# EAGLE schematic Team26vFinal (EAGLE 8.0.2)

## Sheet 1 of 2
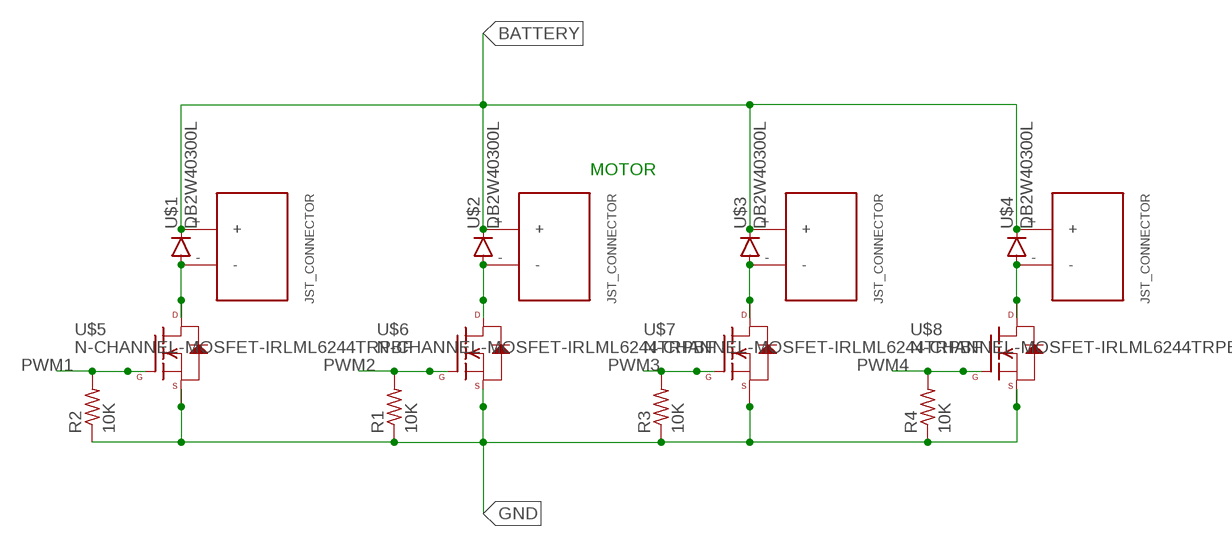
[diagram p0: schematic, sheet 1]

### Parts
MOTOR  JST_CONNECTOR_FEMALE  [JST_CONNECTOR_FEMALE]
MOTOR1  JST_CONNECTOR_FEMALE  [JST_CONNECTOR_FEMALE]
MOTOR2  JST_CONNECTOR_FEMALE  [JST_CONNECTOR_FEMALE]
MOTOR3  JST_CONNECTOR_FEMALE  [JST_CONNECTOR_FEMALE]
R1  10K  R-US_R0603  [R0603]
R2  10K  R-US_R0603  [R0603]
R3  10K  R-US_R0603  [R0603]
R4  10K  R-US_R0603  [R0603]
U$1  DB2W40300L  [MINI2-F3-B]
U$2  DB2W40300L  [MINI2-F3-B]
U$3  DB2W40300L  [MINI2-F3-B]
U$4  DB2W40300L  [MINI2-F3-B]
U$5  N-CHANNEL-MOSFET-IRLML6244TRPBF  [SOT23-3]
U$6  N-CHANNEL-MOSFET-IRLML6244TRPBF  [SOT23-3]
U$7  N-CHANNEL-MOSFET-IRLML6244TRPBF  [SOT23-3]
U$8  N-CHANNEL-MOSFET-IRLML6244TRPBF  [SOT23-3]

### Nets
BATTERY: MOTOR1.+ MOTOR2.+ MOTOR3.+ MOTOR.+ U$1.NEG(GPIN) U$2.NEG(GPIN) U$3.NEG(GPIN) U$4.NEG(GPIN) ; also sheet 2
GND: R1.1 R2.1 R3.1 R4.1 U$5.2(S) U$6.2(S) U$7.2(S) U$8.2(S) ; also sheet 2
N$2: MOTOR.- U$2.POS(PPIN) U$6.3(D)
N$14: MOTOR1.- U$1.POS(PPIN) U$5.3(D)
N$15: MOTOR2.- U$3.POS(PPIN) U$7.3(D)
N$16: MOTOR3.- U$4.POS(PPIN) U$8.3(D)
PWM1: R2.2 U$5.1(G) ; also sheet 2
PWM2: R1.2 U$6.1(G) ; also sheet 2
PWM3: R3.2 U$7.1(G) ; also sheet 2
PWM4: R4.2 U$8.1(G) ; also sheet 2

### Notes on the sheet
- MOTOR

## Sheet 2 of 2
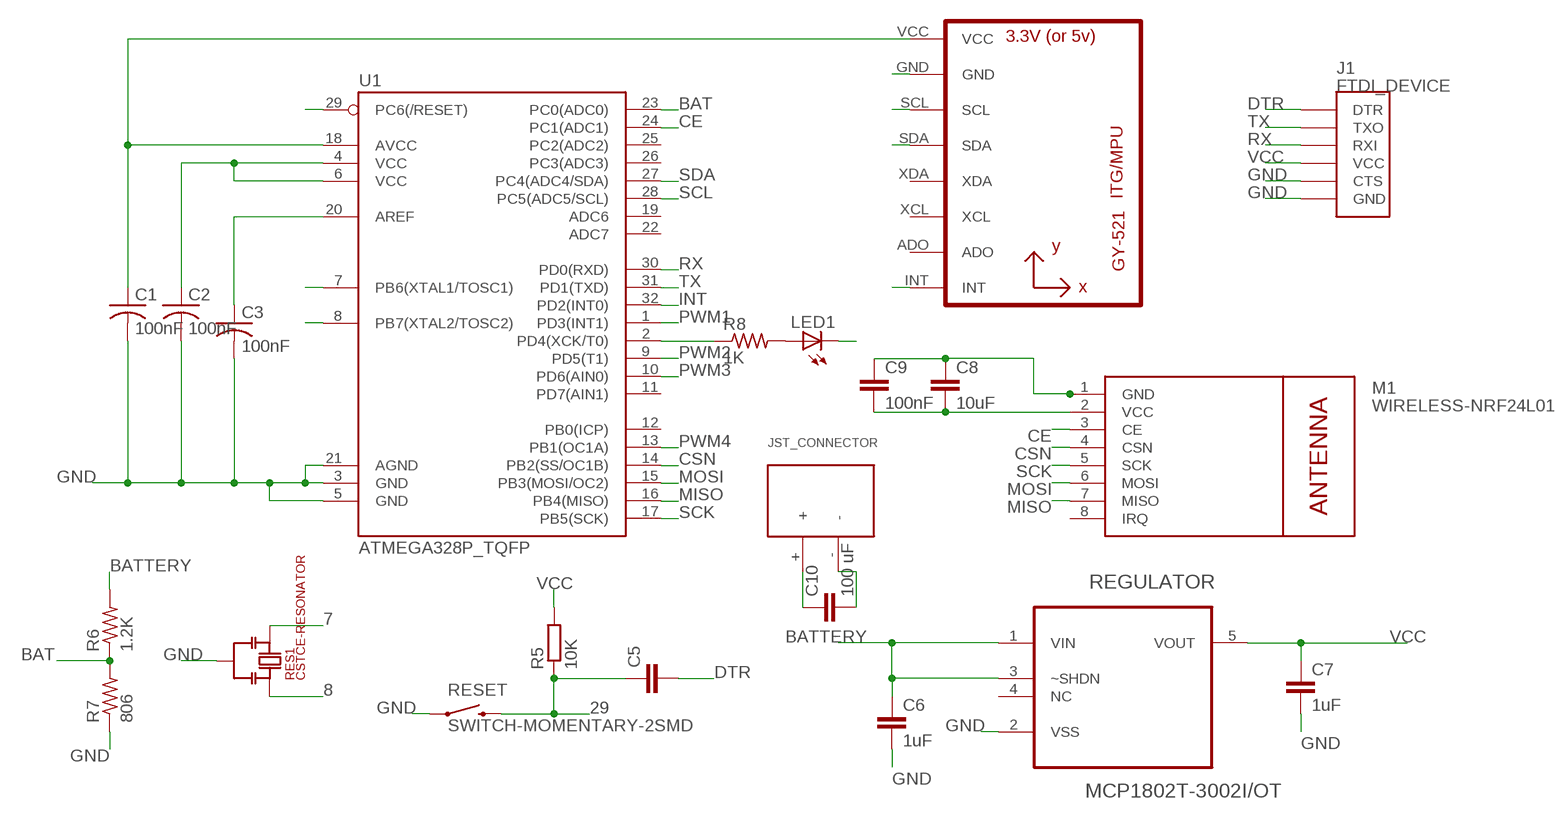
[diagram p1: schematic, sheet 2]

### Parts
C1  100nF  C-USC0603  [C0603]
C2  100nF  C-USC0603  [C0603]
C3  100nF  C-USC0603  [C0603]
C5  C-EUC0603  [C0603]
C6  1uF  C-EUC0603  [C0603]
C7  1uF  C-EUC0603  [C0603]
C8  10uF  C-EUC0603  [C0603]
C9  100nF  C-EUC0603  [C0603]
C10  100 uF  C-EUC1210  [C1210]
J1  FTDI_DEVICE  [FTDI_DEVICE_SIDE]
LED1  LEDCHIP-LED0603  [CHIP-LED0603]
M1  WIRELESS-NRF24L01  [WIRELESS-NRF24L01]
R5  10K  R-EU_R0603  [R0603]
R6  1.2K  R-US_R0603  [R0603]
R7  806  R-US_R0603  [R0603]
R8  1K  R-US_R0603  [R0603]
REGULATOR  MCP1802T-3002I/OT  [SOT95P270X145-5N]
RES1  CSTCE-RESONATOR  [CSTCE16M0V53-R0]
RESET  SWITCH-MOMENTARY-2SMD  [TACTILE-SWITCH-SMD]
U1  ATMEGA328P_TQFP  [TQFP32-08]
U2  GY-521MPU6050  [GY-521]
U$9  JST_CONNECTOR_FEMALE  [JST_CONNECTOR_FEMALE]

### Nets
7: RES1.P$3 U1.7(PB6(XTAL1/TOSC1))
8: RES1.P$1 U1.8(PB7(XTAL2/TOSC2))
29: C5.1 R5.1 RESET.3 U1.29(PC6(/RESET))
BAT: R6.1 R7.2 U1.23(PC0(ADC0))
BATTERY: C6.1 C10.1 R6.2 REGULATOR.1(VIN) REGULATOR.3(~SHDN) U$9.+ ; also sheet 1
CE: M1.3(CE) U1.24(PC1(ADC1))
CSN: M1.4(CSN) U1.14(PB2(SS/OC1B))
DTR: C5.2 J1.P$1(DTR)
GND: C1.2 C2.2 C3.2 C6.2 C7.2 C8.1 C9.1 C10.2 J1.P$5(CTS) J1.P$6(GND) LED1.C M1.1(GND) R7.1 REGULATOR.2(VSS) RES1.P$2 RESET.1 U1.3(GND) U1.5(GND) U1.21(AGND) U2.GND U$9.- ; also sheet 1
INT: U1.32(PD2(INT0)) U2.INT
MISO: M1.7(MISO) U1.16(PB4(MISO))
MOSI: M1.6(MOSI) U1.15(PB3(MOSI/OC2))
N$10: LED1.A R8.2
N$11: C3.1 U1.20(AREF)
N$12: R8.1 U1.2(PD4(XCK/T0))
PWM1: U1.1(PD3(INT1)) ; also sheet 1
PWM2: U1.9(PD5(T1)) ; also sheet 1
PWM3: U1.10(PD6(AIN0)) ; also sheet 1
PWM4: U1.13(PB1(OC1A)) ; also sheet 1
RX: J1.P$3(RXI) U1.30(PD0(RXD))
SCK: M1.5(SCK) U1.17(PB5(SCK))
SCL: U1.28(PC5(ADC5/SCL)) U2.SCL
SDA: U1.27(PC4(ADC4/SDA)) U2.SDA
TX: J1.P$2(TXO) U1.31(PD1(TXD))
VCC: C1.1 C2.1 C7.1 C8.2 C9.2 J1.P$4(VCC) M1.2(VCC) R5.2 REGULATOR.5(VOUT) U1.4(VCC) U1.6(VCC) U1.18(AVCC) U2.VCC
Unconnected: M1.8(IRQ) REGULATOR.4(NC) U1.11(PD7(AIN1)) U1.12(PB0(ICP)) U1.19(ADC6) U1.22(ADC7) U1.25(PC2(ADC2)) U1.26(PC3(ADC3)) U2.ADO U2.XCL U2.XDA

## Library data of the parts
C1-C3 = resistor:C-US: CAPACITOR, American symbol
C5-C10 = rcl:C-EU: CAPACITOR, European symbol
J1 = quad (1):FTDI_DEVICE: Connector which mates to FTDI basic or FTDI cable.
LED1 = led:LED: LED OSRAM: - CHIPLED LG R971, LG N971, LY N971, LG Q971, LY Q971, LO R971, LY R971 LH N974, LH R974 LS Q976, LO Q976, LY Q976 LO Q996 - Hyper CHIPLED LW Q18S LB Q993, LB Q99A, LB R99A - SideLED LS A670, LO A670, LY A670, LG A670, LP A670 LB A673, LV A673, LT A673, LW A673 LH A674 LY A675 LS A676, LA A676, LO A676, LY A676, LW A676 LS A679, LY A679, LG A679 - Hyper Micro SIDELED® LS Y876, LA Y876, LO Y876, LY Y876 LT Y87S - SmartLED LW L88C, LW L88S LB L89C, LB L89S, LG L890 LS L89K, LO L89K, LY L89K LS L896, LA L896, LO L896, LY L896 - TOPLED LS T670, LO T670, LY T670, LG T670, LP T670 LSG T670, LSP T670, LSY T670, LOP T670, LYG T670 LG T671, LOG T671, LSG T671 LB T673, LV T673, LT T673, LW T673 LH T674 LS T676, LA T676, LO T676, LY T676, LB T676, LH T676, LSB T676, LW T676 LB T67C, LV T67C, LT T67C, LS T67K, LO T67K, LY T67K, LW E67C LS E67B, LA E67B, LO E67B, LY E67B, LB E67C, LV E67C, LT E67C LW T67C LS T679, LY T679, LG T679 LS T770, LO T770, LY T770, LG T770, LP T770 LB T773, LV T773, LT T773, LW T773 LH T774 LS E675, LA E675, LY E675, LS T675 LS T776, LA T776, LO T776, LY T776, LB T776 LHGB T686 LT T68C, LB T68C - Hyper Mini TOPLED® LB M676 - Mini TOPLED Santana® LG M470 LS M47K, LO M47K, LY M47K Source: http://www.osram.convergy.de LUXEON: - LUMILED® LXK2-PW12-R00, LXK2-PW12-S00, LXK2-PW14-U00, LXK2-PW14-V00 LXK2-PM12-R00, LXK2-PM12-S00, LXK2-PM14-U00 LXK2-PE12-Q00, LXK2-PE12-R00, LXK2-PE12-S00, LXK2-PE14-T00, LXK2-PE14-U00 LXK2-PB12-K00, LXK2-PB12-L00, LXK2-PB12-M00, LXK2-PB14-N00, LXK2-PB14-P00, LXK2-PB14-Q00 LXK2-PR12-L00, LXK2-PR12-M00, LXK2-PR14-Q00, LXK2-PR14-R00 LXK2-PD12-Q00, LXK2-PD12-R00, LXK2-PD12-S00 LXK2-PH12-R00, LXK2-PH12-S00 LXK2-PL12-P00, LXK2-PL12-Q00, LXK2-PL12-R00 Source: www.luxeon.com KINGBRIGHT: KA-3528ASYC Source: www.kingbright.com
M1 = quad (1):WIRELESS-NRF24L01: 2.4 GHz Wireless Module based on NRF24L01 chip
MOTOR MOTOR1-MOTOR3 U$9 = quad (1):JST_CONNECTOR_FEMALE
R1-R4 = rcl:R-US_: RESISTOR, American symbol
R5 = resistor:R-EU_: RESISTOR, European symbol
R6-R8 = resistor:R-US_: RESISTOR, American symbol
REGULATOR = quad (1):MCP1802T-3002I/OT: Low Quiescent Current LDO; MPN: MCP1802T-3002I/OT; OC_FARNELL: 1578373; OC_NEWARK: 54M4837; PACKAGE: SOT-5; SUPPLIER: Microchip
RES1 = quad (1):CSTCE-RESONATOR: Murata Electronics Resonator
RESET = quad (1):SWITCH-MOMENTARY-2: Various NO switches- pushbuttons, reed, etc; PROD_ID: SWCH-08247
U1 = quad (1):ATMEGA328P_TQFP; PROD_ID: IC-09069
U2 = quad (1):GY-521
U$1-U$4 = quad (1):DB2W40300L
U$5-U$8 = quad (1):N-CHANNEL-MOSFET: N-Channel MOSFET Mode Field Effect Transistor; DATASHEET: http://www.mouser.com/ds/2/196/irlml6244pbf-936666.pdf; MOUSER: 942-IRLML6244TRPBF; URL: http://www.mouser.com/Search/ProductDetail.aspx?R=IRLML6244TRPBFvirtualkey57370000virtualkey942-IRLML6244TRPBF